# Altium schematic sheet Capstone_Signal_Conditioners_Subsystem_Test_Schematic.SchDoc
size A; SheetNumber: 11; SheetTotal: 15
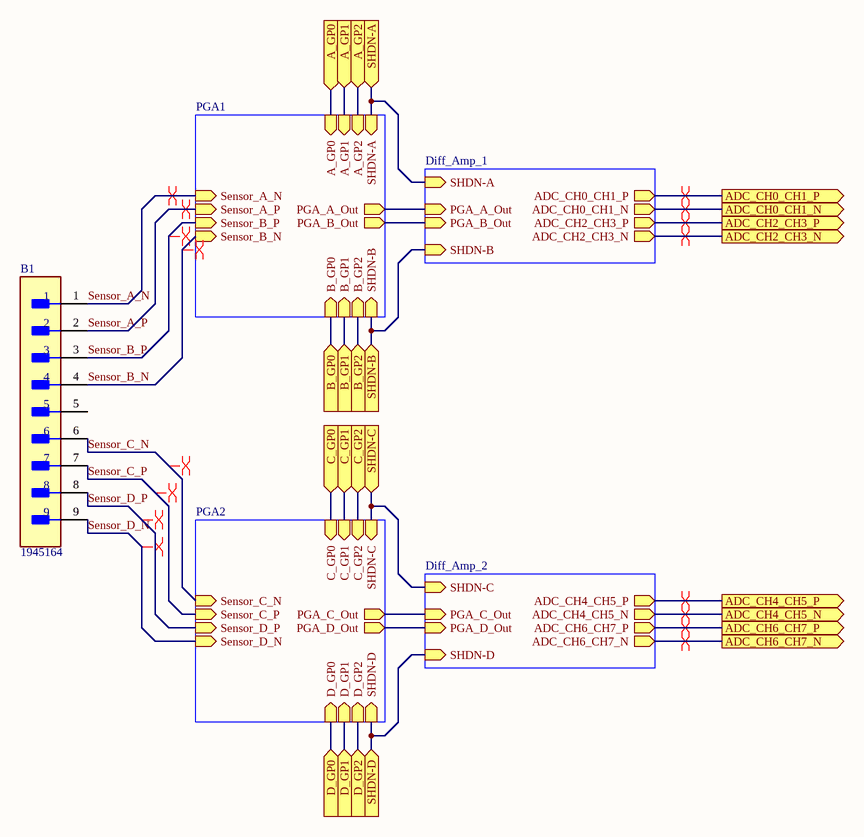
[diagram p0: Capstone_Signal_Conditioners_Subsystem_Test_Schematic.SchDoc]

## Parts
B1  1945164  [FP-4-644456-0-MFG]

## Sub-sheets
Diff_Amp_1 = LTC6362_Schematic.SchDoc: PGA_A_Out (in), PGA_B_Out (in), SHDN-A (in), SHDN-B (in), ADC_CH0_CH1_P (out), ADC_CH0_CH1_N (out), ADC_CH2_CH3_N (out), ADC_CH2_CH3_P (out)
Diff_Amp_2 = LTC6362_Schematic_2.SchDoc: SHDN-C (in), SHDN-D (in), ADC_CH6_CH7_N (out), ADC_CH6_CH7_P (out), ADC_CH4_CH5_N (out), ADC_CH4_CH5_P (out), PGA_C_Out (in), PGA_D_Out (in)
PGA1 = THS7002CPWP_Schematic.SchDoc: Sensor_A_P (in), Sensor_A_N (in), Sensor_B_P (in), Sensor_B_N (in), A_GP0 (in), A_GP1 (in), A_GP2 (in), PGA_A_Out (out), PGA_B_Out (out), B_GP0 (in), B_GP1 (in), B_GP2 (in), SHDN-A (in), SHDN-B (in)
PGA2 = THS7002CPWP_Schematic_2.SchDoc: Sensor_C_P (in), Sensor_C_N (in), Sensor_D_P (in), Sensor_D_N (in), C_GP0 (in), D_GP0 (in), C_GP1 (in), C_GP2 (in), D_GP1 (in), D_GP2 (in), SHDN-C (in), SHDN-D (in), PGA_C_Out (out), PGA_D_Out (out)

## Ports
A_GP0 (in), A_GP1 (in), A_GP2 (in), ADC_CH0_CH1_N (out), ADC_CH0_CH1_P (out), ADC_CH2_CH3_N (out), ADC_CH2_CH3_P (out), ADC_CH4_CH5_N (out), ADC_CH4_CH5_P (out), ADC_CH6_CH7_N (out), ADC_CH6_CH7_P (out), B_GP0 (in), B_GP1 (in), B_GP2 (in), C_GP0 (in), C_GP1 (in), C_GP2 (in), D_GP0 (in), D_GP1 (in), D_GP2 (in), SHDN-A (in), SHDN-B (in), SHDN-C (in), SHDN-D (in)

## Nets
A_GP0: port A_GP0, sheet PGA1/A_GP0
A_GP1: port A_GP1, sheet PGA1/A_GP1
A_GP2: port A_GP2, sheet PGA1/A_GP2
ADC_CH0_CH1_N: port ADC_CH0_CH1_N, sheet Diff_Amp_1/ADC_CH0_CH1_N
ADC_CH0_CH1_P: port ADC_CH0_CH1_P, sheet Diff_Amp_1/ADC_CH0_CH1_P
ADC_CH2_CH3_N: port ADC_CH2_CH3_N, sheet Diff_Amp_1/ADC_CH2_CH3_N
ADC_CH2_CH3_P: port ADC_CH2_CH3_P, sheet Diff_Amp_1/ADC_CH2_CH3_P
ADC_CH4_CH5_N: port ADC_CH4_CH5_N, sheet Diff_Amp_2/ADC_CH4_CH5_N
ADC_CH4_CH5_P: port ADC_CH4_CH5_P, sheet Diff_Amp_2/ADC_CH4_CH5_P
ADC_CH6_CH7_N: port ADC_CH6_CH7_N, sheet Diff_Amp_2/ADC_CH6_CH7_N
ADC_CH6_CH7_P: port ADC_CH6_CH7_P, sheet Diff_Amp_2/ADC_CH6_CH7_P
B_GP0: port B_GP0, sheet PGA1/B_GP0
B_GP1: port B_GP1, sheet PGA1/B_GP1
B_GP2: port B_GP2, sheet PGA1/B_GP2
C_GP0: port C_GP0, sheet PGA2/C_GP0
C_GP1: port C_GP1, sheet PGA2/C_GP1
C_GP2: port C_GP2, sheet PGA2/C_GP2
D_GP0: port D_GP0, sheet PGA2/D_GP0
D_GP1: port D_GP1, sheet PGA2/D_GP1
D_GP2: port D_GP2, sheet PGA2/D_GP2
Sensor_A_N: B1.1 ; sheet PGA1/Sensor_A_N
Sensor_A_P: B1.2 ; sheet PGA1/Sensor_A_P
Sensor_B_N: B1.4 ; sheet PGA1/Sensor_B_N
Sensor_B_P: B1.3 ; sheet PGA1/Sensor_B_P
Sensor_C_N: B1.6 ; sheet PGA2/Sensor_C_N
Sensor_C_P: B1.7 ; sheet PGA2/Sensor_C_P
Sensor_D_N: B1.9 ; sheet PGA2/Sensor_D_N
Sensor_D_P: B1.8 ; sheet PGA2/Sensor_D_P
SHDN-A: port SHDN-A, sheet PGA1/SHDN-A, sheet Diff_Amp_1/SHDN-A
SHDN-B: port SHDN-B, sheet PGA1/SHDN-B, sheet Diff_Amp_1/SHDN-B
SHDN-C: port SHDN-C, sheet PGA2/SHDN-C, sheet Diff_Amp_2/SHDN-C
SHDN-D: port SHDN-D, sheet PGA2/SHDN-D, sheet Diff_Amp_2/SHDN-D
(unnamed): sheet PGA1/PGA_A_Out, sheet Diff_Amp_1/PGA_A_Out
(unnamed): sheet PGA1/PGA_B_Out, sheet Diff_Amp_1/PGA_B_Out
(unnamed): sheet PGA2/PGA_C_Out, sheet Diff_Amp_2/PGA_C_Out
(unnamed): sheet PGA2/PGA_D_Out, sheet Diff_Amp_2/PGA_D_Out

Not connected (* = marked no-connect by the designer): B1 5

## Layout directives
differential pair: ADC_CH0_CH1_N, ADC_CH0_CH1_P, ADC_CH2_CH3_N, ADC_CH2_CH3_P, ADC_CH4_CH5_N, ADC_CH4_CH5_P, ADC_CH6_CH7_N, ADC_CH6_CH7_P, Sensor_A_N, Sensor_A_P, Sensor_B_N, Sensor_B_P, Sensor_C_N, Sensor_C_P, Sensor_D_N, Sensor_D_P

## Library data of the parts
B1 = CMP-03369-000038-1: CONN HEADER VERT 9POS 3.5MM; Manufacturer Part Number: 4-644456-0; Manufacturer: TE Connectivity; Pitch: 2.54mm; Current Rating: 5A; Conn Gender: Male; Number Of Contacts: 10; Conn Orientation: Vertical; Voltage Rating: 250V; Number Of Rows: 1; Device Class L3: unset; Octopart: https://octopart.com/4-644456-0-te+connectivity-39514173; Mouser Description: Headers & Wire Housings NARROW FLT HDR 10P Straight Post; ComponentLink2Description: Datasheet; Height: 0.408inch; Package: 4-644456-0; RoHS: TRUE; Temperature Range High: +105°C; Digikey Description: CONN HEADER VERT 10POS 2.54MM; Temperature: -55°C to +105°C; Device Class L2: Headers and Wire Housings; Automotive: No; Lead Free: Yes; Contact Material: Tin; Temperature Range Low: -55°C; Footprint Url: https://www.te.com/commerce/DocumentDelivery/DDEController?Action=showdoc&DocId=Customer+Drawing%7F644456%7FD2%7Fpdf%7FEnglish%7FENG_CD_644456_D2.pdf%7F4-644456-0; Device Class L1: Connectors; Category: Conn; ComponentLink2URL: https://www.te.com/commerce/DocumentDelivery/DDEController?Action=showdoc&DocId=Data+Sheet%7F82056_MTA%7F0818%7Fpdf%7FEnglish%7FENG_DS_82056_MTA_0818.pdf%7F4-644456-0